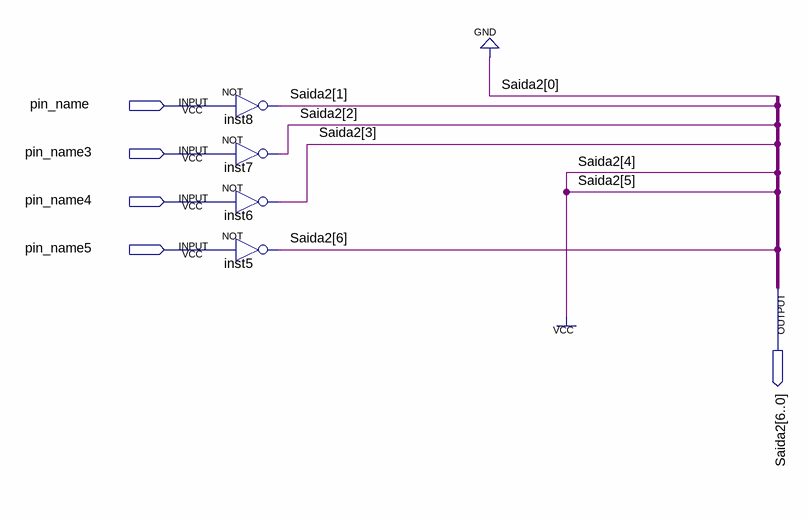
[diagram p0: schematic sheet]
// Quartus schematic converso_dezena.bdf as structural Verilog: 4 symbols, 5 pins
module converso_dezena (
  input  pin_name,
  input  pin_name3,
  input  pin_name4,
  input  pin_name5,
  output [6:0] Saida2
);

  not inst8 (Saida2[1], pin_name);
  not inst7 (Saida2[2], pin_name3);
  not inst6 (Saida2[3], pin_name4);
  not inst5 (Saida2[6], pin_name5);

  assign {Saida2[5:4], Saida2[0]} = 3'b110;
endmodule
